# EAGLE design BreaV7 (EAGLE 9.1.3)

## Sheet 1 of 3
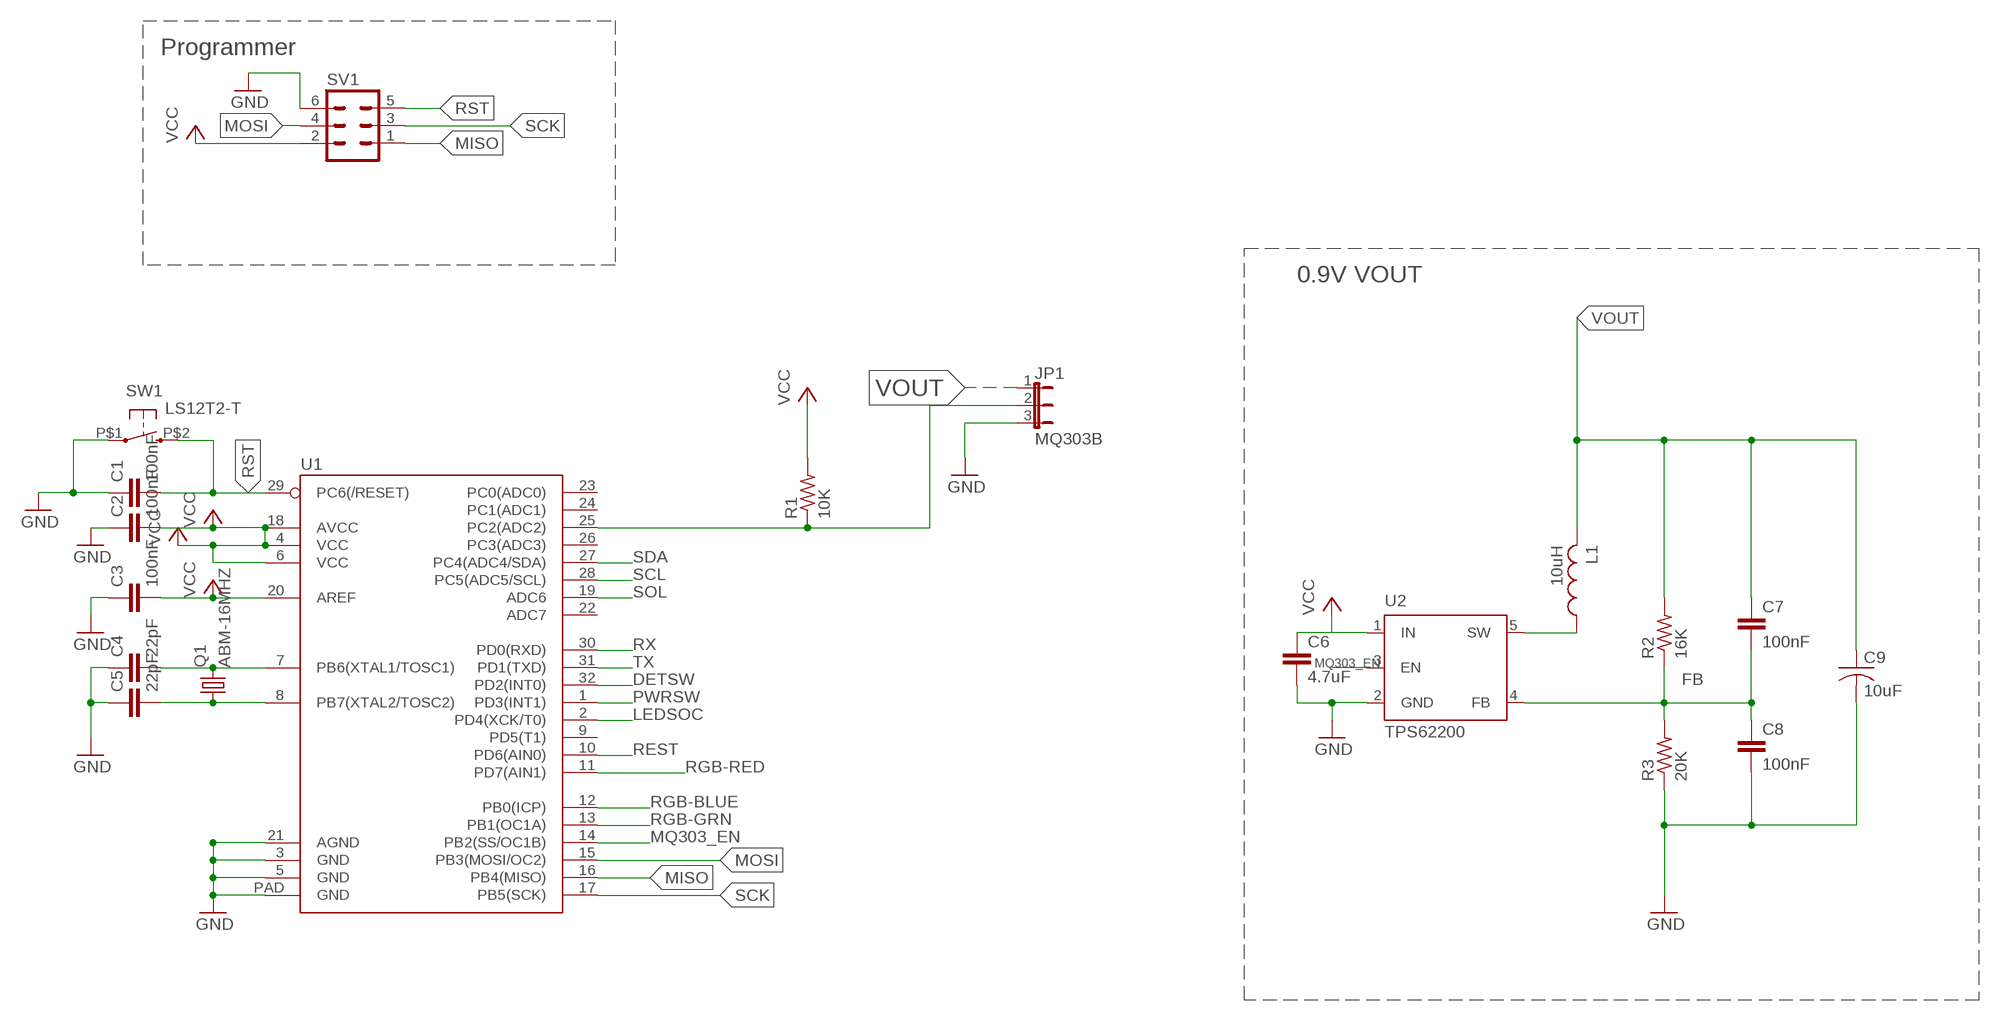
[diagram p0: schematic, sheet 1]

### Parts
C1  100nF  C-EUC0603  [C0603]
C2  100nF  C-EUC0603  [C0603]
C3  100nF  C-EUC0603  [C0603]
C4  22pF  C-EUC0603  [C0603]
C5  22pF  C-EUC0603  [C0603]
C6  4.7uF  C-EUC0402  [C0402]
C7  100nF  C-EUC0402  [C0402]
C8  100nF  C-EUC0402  [C0402]
C9  10uF  C-USC0805K  [C0805K]
JP1  MQ303B  JP2E  [JP2]
L1  10uH  L-USL2825P  [L2825P]
Q1  ABM-16MHZ  [ABM-16MHZ]
R1  10K  R-US_R0402  [R0402]
R2  16K  R-US_R0402  [R0402]
R3  20K  R-US_R0402  [R0402]
SV1  MA03-2  [MA03-2]
SW1  LS12T2-T  [LS12T2-T]
U1  ATMEGA328P_MLFMLF32  [MLF32-PAD]
U2  TPS62200  [TPS62200]

### Nets
DETSW: U1.32(PD2(INT0)) ; also sheet 2
FB: C7.2 C8.1 R2.1 R3.2 U2.4(FB)
GND: C1.1 C2.1 C3.1 C4.1 C5.1 C6.2 C8.2 C9.2 JP1.3 R3.1 SV1.6(MISO) SW1.P$1(S1) U1.3(GND) U1.5(GND) U1.21(AGND) U1.PAD(GND) U2.2(GND) ; also sheet 2,3
LEDSOC: U1.2(PD4(XCK/T0))
MISO: SV1.1 U1.16(PB4(MISO))
MOSI: SV1.4 U1.15(PB3(MOSI/OC2))
MQ303_EN: U1.14(PB2(SS/OC1B)) U2.3(EN)
N$1: C5.2 Q1.P$1 U1.8(PB7(XTAL2/TOSC2))
N$2: C4.2 Q1.P$2 U1.7(PB6(XTAL1/TOSC1))
N$3: JP1.2 R1.1 U1.25(PC2(ADC2))
N$7: C6.1 U2.1(IN)
PWRSW: U1.1(PD3(INT1)) ; also sheet 2
REST: U1.10(PD6(AIN0)) ; also sheet 2
RGB-BLUE: U1.12(PB0(ICP)) ; also sheet 2
RGB-GRN: U1.13(PB1(OC1A)) ; also sheet 2
RGB-RED: U1.11(PD7(AIN1)) ; also sheet 2
RST: C1.2 SV1.5(VTG) SW1.P$2(S2) U1.29(PC6(/RESET))
RX: U1.30(PD0(RXD)) ; also sheet 2
SCK: SV1.3 U1.17(PB5(SCK))
SCL: U1.28(PC5(ADC5/SCL)) ; also sheet 3
SDA: U1.27(PC4(ADC4/SDA)) ; also sheet 3
SOL: U1.19(ADC6) ; also sheet 2
SW: L1.1 U2.5(SW)
TX: U1.31(PD1(TXD)) ; also sheet 2
VCC: C2.2 C3.2 R1.2 SV1.2 U1.4(VCC) U1.6(VCC) U1.18(AVCC) U1.20(AREF) ; also sheet 2,3
VOUT: C7.1 C9.1 JP1.1 L1.2 R2.2
Unconnected: U1.9(PD5(T1)) U1.22(ADC7) U1.23(PC0(ADC0)) U1.24(PC1(ADC1)) U1.26(PC3(ADC3))

### Notes on the sheet
- Programmer
- 0.9V VOUT

## Sheet 2 of 3
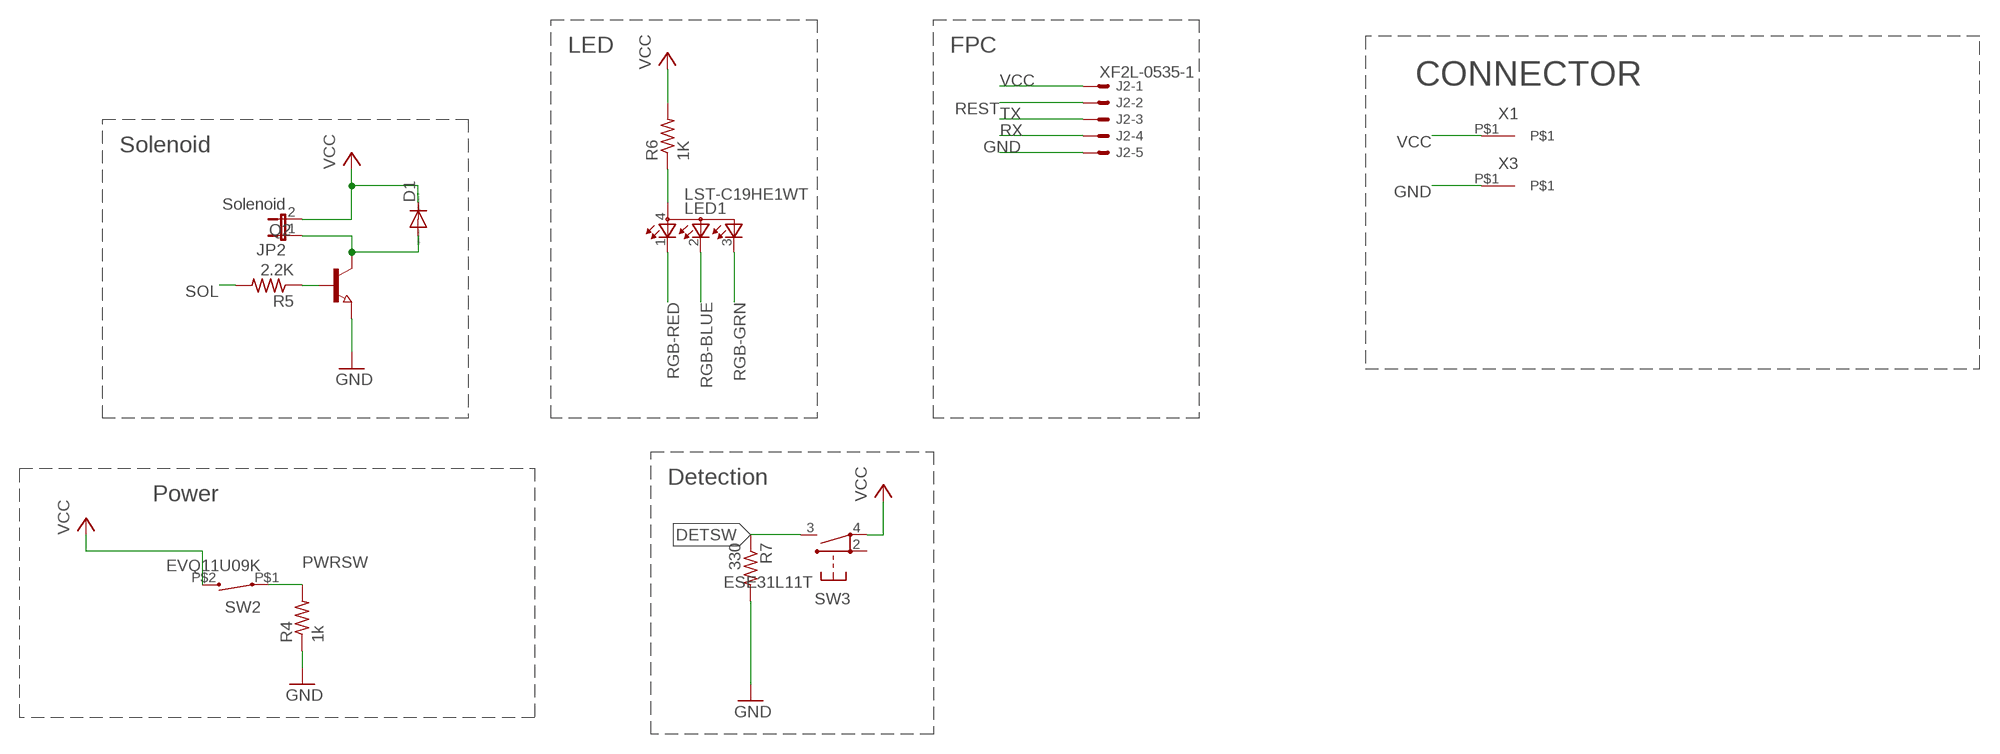
[diagram p1: schematic, sheet 2]

### Parts
D1  DIODE-SOD123  [SOD123]
J2  XF2L-0535-1  [XF2L-0535-1]
JP2  Solenoid  JP1E  [JP1]
LED1  LST-C19HE1WT  [LST-C19HE1WT]
Q2  NPN-TRANSISTOR_SOT23  [SOT23]
R4  1k  R-US_R0402  [R0402]
R5  2.2K  R-US_R0402  [R0402]
R6  1K  R-US_R0402  [R0402]
R7  330  R-US_R0402  [R0402]
SW2  EVQ11U09K  [EVQ11U-09K]
SW3  ESE31L11T  [SWITCH]
X1  CON-1PIN  [CON-1PIN]
X3  CON-1PIN  [CON-1PIN]

### Nets
DETSW: R7.1 SW3.3 ; also sheet 1
GND: J2.5 Q2.2(E) R4.1 R7.2 X3.P$1 ; also sheet 1,3
N$5: LED1.4(A) R6.1
N$9: D1.A JP2.1 Q2.3(C)
N$10: Q2.1(B) R5.1
PWRSW: R4.2 SW2.P$1 ; also sheet 1
REST: J2.2 ; also sheet 1
RGB-BLUE: LED1.2(CGREEN) ; also sheet 1
RGB-GRN: LED1.3(CBLUE) ; also sheet 1
RGB-RED: LED1.1(CRED) ; also sheet 1
RX: J2.4 ; also sheet 1
SOL: R5.2 ; also sheet 1
TX: J2.3 ; also sheet 1
VCC: D1.C J2.1 JP2.2 R6.2 SW2.P$2 SW3.4(C3) X1.P$1 ; also sheet 1,3
Unconnected: SW3.2(C2)

### Notes on the sheet
- LED | FPC
- CONNECTOR
- Solenoid
- Detection
- Power

## Sheet 3 of 3
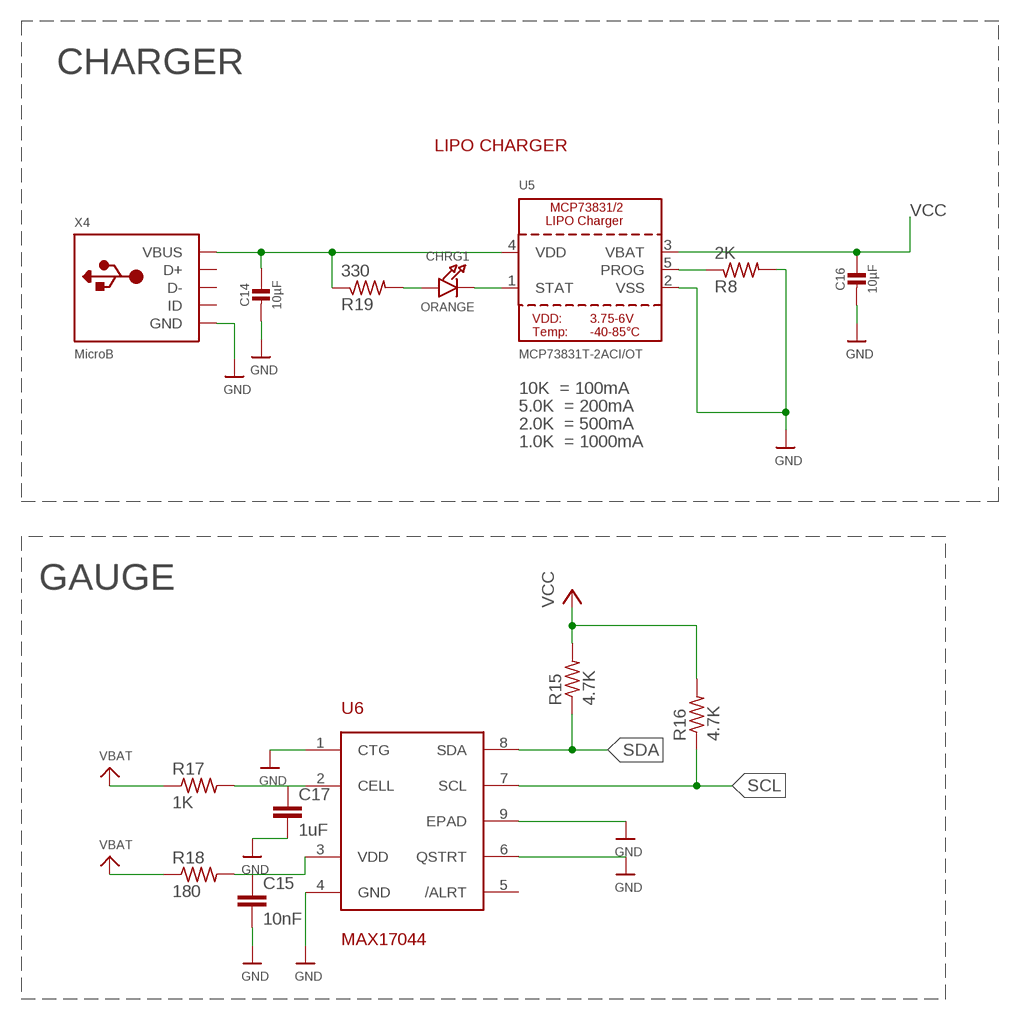
[diagram p2: schematic, sheet 3]

### Parts
C14  10µF  CAP_CERAMIC0805-NOOUTLINE  [0805-NO]
C15  10nF  C-EUC0603  [C0603]
C16  10µF  CAP_CERAMIC0805-NOOUTLINE  [0805-NO]
C17  1uF  C-EUC0603  [C0603]
CHRG1  ORANGE  LED0805_NOOUTLINE  [CHIPLED_0805_NOOUTLINE]
R8  2K  R-US_R0402  [R0402]
R15  4.7K  R-US_R0402  [R0402]
R16  4.7K  R-US_R0402  [R0402]
R17  1K  R-US_R0402  [R0402]
R18  180  R-US_R0402  [R0402]
R19  330  R-US_R0402  [R0402]
U5  MCP73831T-2ACI/OT  MCP73831/2  [SOT23-5]
U6  MAX17044  [TDFN]
X4  MicroB  USBMICRO_20329  [4UCONN_20329]

### Nets
GND: C14.2 C15.2 C16.2 C17.2 R8.2 U5.2(VSS) U6.1(CTG) U6.4(GND) U6.6(QSTRT) U6.9(EPAD) X4.BASE@1(GND) X4.BASE@2(GND) X4.GND X4.SPRT@1(GND) X4.SPRT@2(GND) X4.SPRT@3(GND) X4.SPRT@4(GND) ; also sheet 1,2
N$12: R8.1 U5.5(PROG)
N$13: C17.1 R17.2 U6.2(CELL)
N$15: C15.1 R18.2 U6.3(VDD)
N$16: CHRG1.A R19.2
N$17: CHRG1.C U5.1(STAT)
SCL: R16.1 U6.7(SCL) ; also sheet 1
SDA: R15.1 U6.8(SDA) ; also sheet 1
VBUS2: C14.1 R19.1 U5.4(VDD) X4.VBUS
VCC: C16.1 R15.2 R16.2 R17.1 R18.1 U5.3(VBAT) ; supply symbol labelled VBAT ; also sheet 1,2
Unconnected: U6.5(/ALRT) X4.D+ X4.D- X4.ID

### Notes on the sheet
- CHARGER
- LIPO CHARGER
- 10K  = 100mA
- 5.0K  = 200mA
- 2.0K  = 500mA
- 1.0K  = 1000mA
- GAUGE

## Library data of the parts
C1-C8 C15 C17 = rcl:C-EU: CAPACITOR, European symbol
C9 = resistor:C-US: CAPACITOR, American symbol
C14 C16 = microbuilder:CAP_CERAMIC: Ceramic Capacitors For new designs, use the packages preceded by an '_' character since they are more reliable: The following footprints should be used on most boards: _0402 - Standard footprint for regular board layouts _0603 - Standard footprint for regular board layouts _0805 - Standard footprint for regular board layouts _1206 - Standard footprint for regular board layouts For extremely tight-pitch boards where space is at a premium, the following 'micro-pitch' footprints can be used (smaller pads, no silkscreen outline, etc.): _0402MP - Micro-pitch footprint for very dense/compact boards _0603MP - Micro-pitch footprint for very dense/compact boards _0805MP - Micro-pitch footprint for very dense/compact boards _1206MP - Micro-pitch footprint for very dense/compact boards
CHRG1 = microbuilder:LED: LED 0603 - 0603 Surface Mount Package 2mA: Green LED - Low Power (3.9mcd, 2ma, 1.7Vf) - Digikey: 475-2709-2-ND Orange LED - Low Power (9.8mcd, 2ma, 1.8Vf) - Digikey: 475-1194-2-ND Red LED - Low Power (5mcd, 2ma, 1.8Vf) - Digikey: 475-1195-2-ND Yellow LED - Low Power (7mcd, 2ma, 1.8Vf) - Digikey: 475-1196-2-ND 5mA: Blue LED - Low Power (17mcd, 5ma, 2.9Vf) - Digikey: LNJ937W8CRACT-ND 0805 - 0805 Surface Mount Package 2mA: Red LED (8.8mcd, 2mA, 1.8Vf, Clear) - Low Power [Digikey: 475-2510-1-ND] Green LED (5mcd, 2mA, 1.8Vf, Clear) - Low Power [Digikey: 475-2730-1-ND] Yellow LED (11.3mcd, 2mA, 1.8Vf, Clear) - Low Power [Digikey: 475-2555-1-ND] 20mA: Red LED (104mcd, 20mA, Diffused) - LS R976 [Digikey: 475-1278-6-ND] Red LED (12mcd, 20mA, 2.0Vf, Clear) - APT2012EC [Digikey: 754-1128-1-ND] Green LED (15mcd, 20mA, 2.2Vf, Clear) - APT2012GC [Digikey: 754-1131-1-ND] Orange LED (160mcd, 20mA, 2.1Vf, Clear) - APT2012SECK [Digikey: 754-1130-1-ND] 1206 - 1206 Surface Mount Package Green LED (26mcd, 20mA, Diffused) - LG N971 [Digikey: 475-1407-6-ND] Red LED (15mcd, 20mA, Diffused) - LH N974 [Digikey: 475-1416-6-ND] Cree - Cree High-Power Surface Mount LEDs XPEBWT-L1-0000-00D50 - White 111lm 350mA 2.9Vf 6200K 110° XTEAWT-00-0000-00000LEE3 - White 114lm 350mA 2.85Vf 5000K 115° Everlight - Everlight 45-21 Series Surface Mount LEDs 45-21/QK2C-B2832AC2CB2/2T - Warm White 2000mcd 20mA 3.25Vf 3050K 120° 45-21/LK2C-B38452C4CB2/2T - Nuetral White 2000mcd 20mA 3.25Vf 4150K 120° 45-21/LK2C-B50634C6CB2/2T - Cold White 2200mcd 20mA 3.25Vf 5650K 120° PLCC2 Reverse Mount LS T77K-J1L2-1-0-2-R18-Z - Red 11.25mcd 2mA 1.8Vf 630nm 120° LO T77K-L1M2-24-Z - Orange 19.6mcd 2mA 1.8Vf 606nm 120° LY T77K-K2M1-26-Z - Yellow 15.7mcd 2mA 1.8Vf 587nm 120°
D1 = diode:DIODE-: DIODE
J2 = adafruit:XF2*-05?: OMRON FPC Connector Source : http://www.omron.com/ecb/products/pdf/fpc.pdf
JP1 = jumper:JP2E: JUMPER
JP2 = jumper:JP1E: JUMPER
L1 = resistor:L-US: INDUCTOR, American symbol
LED1 = led:LST-C19HE1WT
Q1 = NewPart:ABM-16MHZ: Crystal 16MHz 18pF
Q2 = semicon-smd-ipc:NPN-TRANSISTOR_: NPN TRANSISTOR
R1-R8 R15-R19 = resistor:R-US_: RESISTOR, American symbol
SV1 = con-lstb:MA03-2: PIN HEADER; OC_FARNELL: unknown; OC_NEWARK: unknown
SW1 = NewPart:LS12T2-T: Side Switch for hardware reset
SW2 = NewPart:EVQ11U09K
SW3 = NewPart:ESE31L11T: Panasonic Detector Switch
U1 = SparkFun-DigitalIC:ATMEGA328P_MLF: 32-Pin Atmega328 part Commonly used on Arduino compatible boards Available in QFP and QFN packages TQFP is IC-09069 QFN is non-stock
U2 = NewPart:TPS62200: TI TPS62200 Buck Converter
U5 = microbuilder:MCP73831/2: MCP73831/2 LIPO Charger VDD: 3.75 - 6V Temp -40 - 85°C Programmable Charge Rate: 15-500mA NOTE: STAT is a tri-state logic output on the MCP73831 and an open-drain output on the MCP73832. SOT23-5 with 4.2V output and tri-state logic on STAT = MCP73831T-2ACI/OT
U6 = NewPart:MAX17044
X1 X3 = NewPart:CON-1PIN: THROUGH HOLE FOR 1-PIN CONNECTOR
X4 = microbuilder:USB: USB Connectors USBMINIB - Surface Mount Female Mini-B USB Connector 4UConnector: 06564

## Board
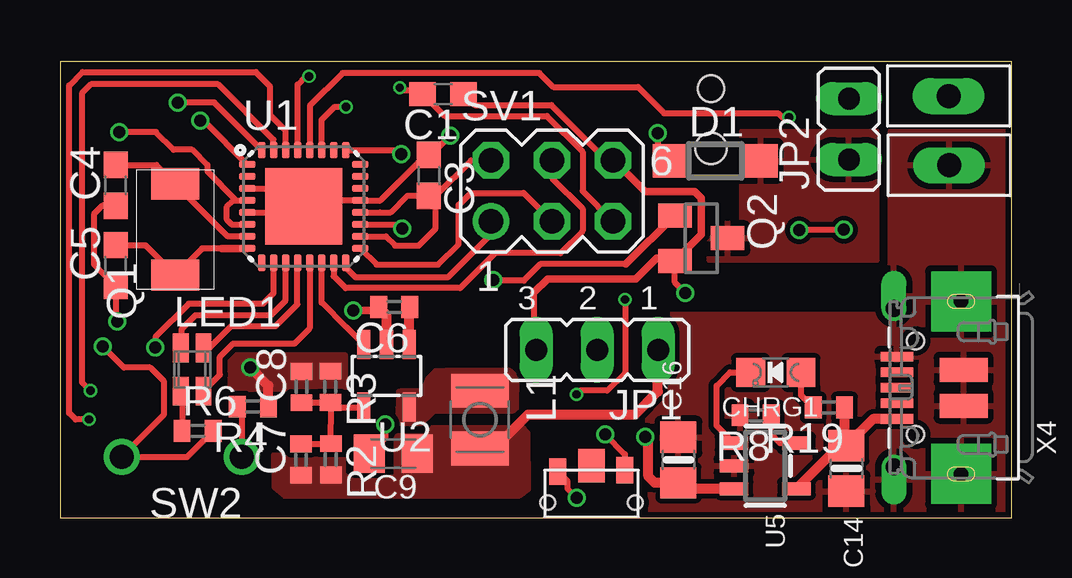
[diagram p3: board, top side]
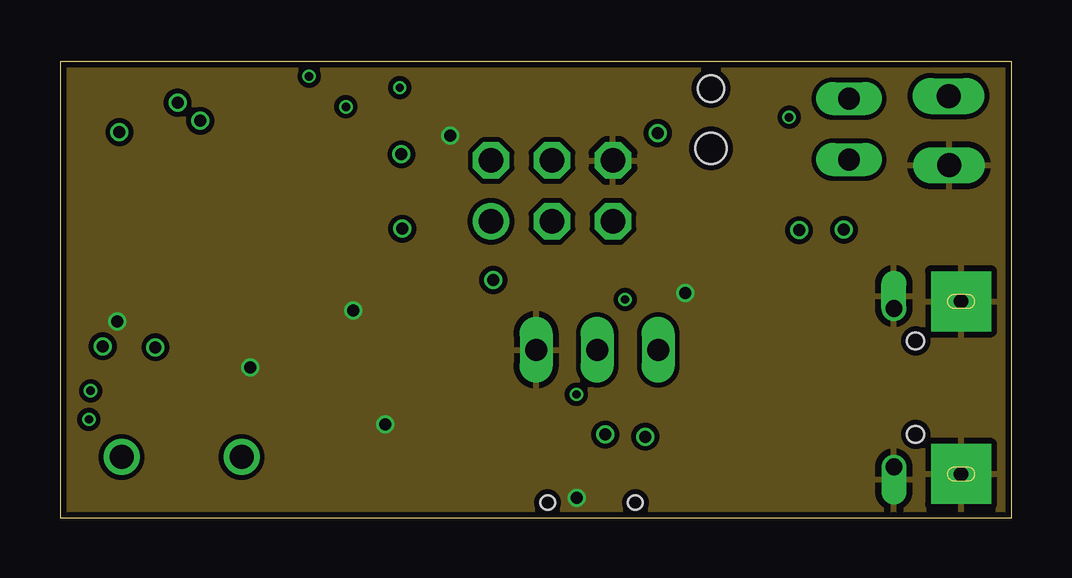
[diagram p4: board, inner layer Route2]
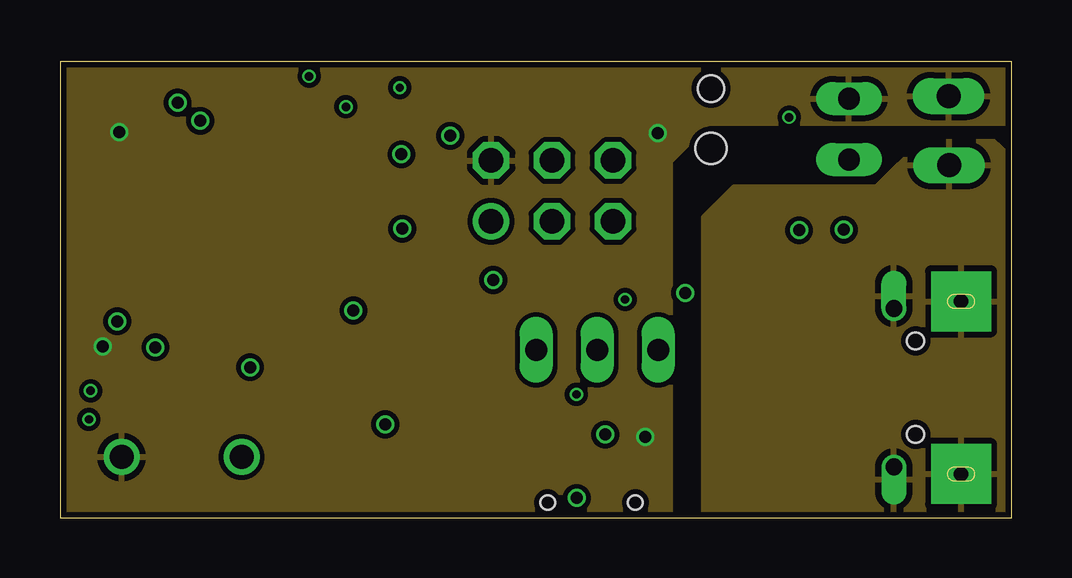
[diagram p5: board, inner layer Route15]
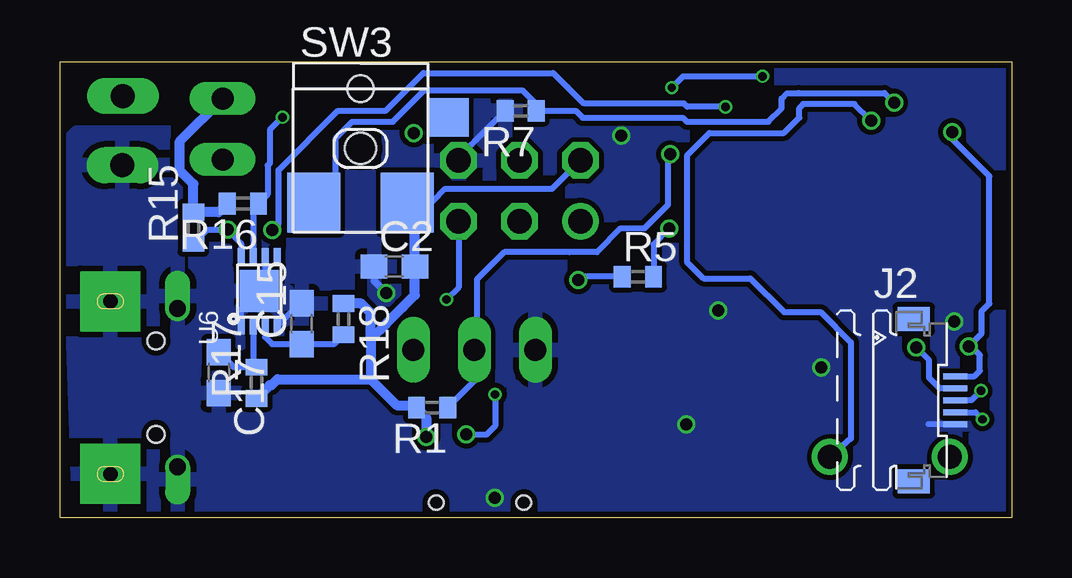
[diagram p6: board, bottom side, seen from below]

Size 39.65 x 19.03 mm. Coordinates in mm from the lower left corner, seen from the top.
Outline: 0,0 39.65,0 39.65,19.03 0,19.03 0,0
Copper layers (1*2*15*16): Top 0.035mm / dielectric 0.2mm / Route2 0.0175mm / dielectric 0.3mm / Route15 0.0175mm / dielectric 0.2mm / Bottom 0.035mm
Design rules "SeeedStudio_4layer_DRU_no_angle_20140221": minimum track width 8mil, minimum drill 12mil, track to track 8mil, track to pad 8mil, pad to pad 8mil, via to via 8mil, smd to smd 0mil, copper to edge 10mil, drill to drill 8mil, minimum pad ring 6mil, minimum via ring 4mil, stop-mask expansion 4mil, vias tented up to drill 25mil, thermal gap 10mil

### Footprints (pad centres in the part's own frame; a part is rotated, then mirrored left to right if it is on the bottom)
C0603 = smd 1.1 x 1: 1 -0.85,0; 2 0.85,0
C0402 = smd 0.7 x 0.9: 1 -0.65,0; 2 0.65,0
C0805K = smd 1.3 x 1.6: 1 -1,0; 2 1,0
0805-NO = smd 1.3 x 1.5: 1 -0.95,0; 2 0.95,0
CHIPLED_0805_NOOUTLINE = smd 1.2 x 1.2: A 0,-1.05; C 0,1.05
SOD123 = smd 1.4 x 1.4: A 1.9,0; C -1.9,0
XF2L-0535-1 = smd 1 x 0.25: 1 1.905,1; 2 1.905,0.5; 3 1.905,0; 4 1.905,-0.5; 5 1.905,-1 | smd 1.34 x 1: M1 0.18,3.388; M2 0.18,-3.388
JP2 = drill 0.914 long: 1 -2.54,0; 2 0,0; 3 2.54,0
JP1 = drill 0.914 long: 1 0,-1.27; 2 0,1.27
L2825P = smd 1.4 x 2.4: 1 -1.2,0; 2 1.2,0
LST-C19HE1WT = smd 0.65 x 1.2: 1 -0.475,0.9; 2 0.475,0.9; 3 0.475,-0.9; 4 -0.475,-0.9
ABM-16MHZ = smd 1.3 x 2: P$1 0.6,-1.6; P$2 4.4,-1.6
SOT23 = smd 1 x 1.4: 1 -0.95,-1.1; 2 0.95,-1.1; 3 0,1.1
R0402 = smd 0.7 x 0.9: 1 -0.65,0; 2 0.65,0
MA03-2 = drill 1.016: 1 -2.54,-1.27 | drill 1.016 octagon: 2 -2.54,1.27; 3 0,-1.27; 4 0,1.27; 5 2.54,-1.27; 6 2.54,1.27
LS12T2-T = smd 1.1 x 0.7: P$1 0.05,-1.41; P$2 0,1.39 | smd 1.4 x 1.1: P$3 -0.2,0 | hole 0.6: 1.35,-1.825; 1.35,1.825
EVQ11U-09K = drill 1: P$1 -2.5,0; P$2 2.5,0
SWITCH = smd 1.7 x 1.6: 2 3.65,1.3 | smd 2.2 x 2.5: 3 -1.95,-2.25; 4 1.95,-2.25 | hole 1.1: 0,2.5 | hole 1.3: 0,0
MLF32-PAD = smd 0.7 x 0.3: 1 -2.35,1.75; 2 -2.35,1.25; 3 -2.35,0.75; 4 -2.35,0.25; 5 -2.35,-0.25; 6 -2.35,-0.75; 7 -2.35,-1.25; 8 -2.35,-1.75; 17 2.35,-1.75; 18 2.35,-1.25; 19 2.35,-0.75; 20 2.35,-0.25; 21 2.35,0.25; 22 2.35,0.75; 23 2.35,1.25; 24 2.35,1.75 | smd 0.3 x 0.7: 9 -1.75,-2.35; 10 -1.25,-2.35; 11 -0.75,-2.35; 12 -0.25,-2.35; 13 0.25,-2.35; 14 0.75,-2.35; 15 1.25,-2.35; 16 1.75,-2.35; 25 1.75,2.35; 26 1.25,2.35; 27 0.75,2.35; 28 0.25,2.35; 29 -0.25,2.35; 30 -0.75,2.35; 31 -1.25,2.35; 32 -1.75,2.35 | smd 3.2 x 3.2: PAD 0,0
TPS62200 = smd 0.55 x 1.2: 1 -0.95,-1.3; 2 0,-1.3; 3 0.95,-1.3; 4 0.95,1.3; 5 -0.95,1.3
SOT23-5 = smd 0.55 x 1.2: 1 -0.95,-1.3; 2 0,-1.3; 3 0.95,-1.3; 4 0.95,1.3; 5 -0.95,1.3
TDFN = smd 0.3 x 0.7: 1 -0.75,-1.45; 2 -0.25,-1.45; 3 0.25,-1.45; 4 0.75,-1.45; 5 0.75,1.45; 6 0.25,1.45; 7 -0.25,1.45; 8 -0.75,1.45 | smd 1.63 x 1.75: 9 0,0
CON-1PIN = drill 1 long: P$1 0,0
4UCONN_20329 = smd 1 x 2: BASE@1 -0.75,-2; BASE@2 0.75,-2 | smd 0.4 x 1.35: D+ 0,0.775; D- -0.65,0.775; GND 1.3,0.775; ID 0.65,0.775; VBUS -1.3,0.775 | drill 0.7 offset: SPRT@1 -3.3,0.9; SPRT@2 3.3,0.9 | drill 0.6 pad 2.5 square: SPRT@3 -3.6,-1.9; SPRT@4 3.6,-1.9 | hole 0.7: -1.95,0; 1.95,0

### Placement (x,y rotation side)
C1  15.96,17.68 180 top
C2  25.71,10.47 0 bottom
C3  15.36,14.28 270 top
C4  2.31,13.87 90 top
C5  2.31,10.53 90 top
C6  13.93,8.79 180 top
C7  10.04,2.43 90 top
C8  10.06,5.46 90 top
C9  13.88,2.68 180 top
C14  32.77,2.07 270 top
C15  29.58,8.1 90 bottom
C16  25.77,2.42 90 top
C17  33.04,6.06 270 bottom
CHRG1  29.83,6.07 90 top
D1  27.3,14.89 0 top
J2  4.26,4.91 0 bottom
JP1  22.38,7.01 180 top
JP2  32.87,16.21 0 top
L1  17.5,4.1 270 top
LED1  5.51,6.19 0 top
Q1  3.21,9.53 90 top
Q2  26.72,11.66 270 top
R1  24.14,4.6 180 bottom
R2  11.28,2.44 270 top
R3  11.27,5.47 270 top
R4  8.04,4.65 180 top
R5  15.57,10.06 0 bottom
R6  5.74,3.63 0 top
R7  20.45,16.98 180 bottom
R8  28.99,4.28 180 top
R15  34.09,12.1 90 bottom
R16  32.03,13.11 180 bottom
R17  31.46,5.64 90 bottom
R18  27.84,8.29 270 bottom
R19  32.04,4.61 180 top
SV1  20.5,13.64 0 top
SW1  22.15,1.99 270 top
SW2  5.07,2.54 180 top
SW3  27.12,15.4 0 bottom
U1  10.16,12.99 0 top
U2  13.61,5.93 180 top
U5  29.39,2.17 270 top
U6  31.35,9.46 0 bottom
X1  37.03,17.6 90 top
X3  37.05,14.71 90 top
X4  35.65,5.43 90 top

### Tracks (layer width: path | path; a pad name or v marks a point on that pad's centre or on a via)
DETSW  (via drill 0.5)
  Top 0.254: v4.9,17.32 6.43,17.32 U1.32
  Bottom 0.254: SW3.3 29.01,13.09 28.15,13.94 28.15,15.83 27.47,16.52 25.78,16.52 24.46,17.83 20.38,17.83 19.8,17.25 R7.1 18.16,16.98 17.87,16.68 16.2,16.68 13.7,16.68 13.53,16.52 10.13,16.52 9.58,17.07 9.58,17.49 9.36,17.71 8.88,17.71 8.87,17.71 5.29,17.71 v4.9,17.32
FB
  Top 0.254: R3.2 11.04,4.61 12.64,4.61 U2.4 | C7.2 R2.1 11.29,4.73 R3.2 | C8.1 arc-90 10.08,4.82 R3.2
GND  (via drill 0.5)
  Top 0.254: U1.3 9.41,13.74 U1.PAD | U1.5 9.91,12.74 U1.PAD | U1.PAD 10.41,13.24 U1.21 13.35,13.24 15.11,15 15.23,15 C3.1 15.46,15.13 v16.26,15.93 | C4.1 1.76,13.01 1.42,12.67 1.42,10.57 C5.1 2.31,8.27 v2.39,8.2 | v13.55,3.9 13.55,3.35 C9.2 | 19.74,9.39 19.74,7.11 JP1.3 | v26.06,9.38 25.62,9.82 Q2.2 | C1.1 17.28,17.21 20.47,17.21 22.78,14.91 SV1.6 | SW1.P$1 21.14,1.54 21.14,1.22 v21.53,0.83
  Top 0.305: SV1.6 23.09,14.91 24.39,13.61 26.45,13.61 26.73,13.33 26.73,11.82 Q2.2 | v12.23,8.65 13.14,8.65 C6.2 | Q2.2 | 19.74,9.39 20.32,9.97 24,9.97 24.86,10.83 25.5,10.83 Q2.2
  Top 0.406: U2.2 13.61,8.46 C6.2 | R4.1 8.69,5.51 v7.92,6.28
  Bottom 0.254: J2.5 3.46,3.91 | C15.2 29.66,8.95 U6.4 | U6.1 32.1,8.71 U6.9 31.1,9.71 U6.6 | SV1.6 23.04,15.03 22.5,15.57 22.49,15.57 22.29,15.77 22.29,15.78 R7.2
  Bottom 0.305: v26.06,9.38 26.56,9.88 C2.1
  pour Top (no thermals): 7.29,6.79 11.87,6.79 11.87,5.37 8.89,5.37 7.27,5.34 7.12,5.49 7.08,6.57
  pour Bottom: 0.25,18.96 29.59,18.71 29.59,16.92 30.45,16.06 38.96,16.06 39.21,15.81 39.21,10.41 38.86,0.42 34.47,0.16 0.5,0.16 0.25,0.42
  pour Route2: 0.21,18.88 39.43,18.88 39.43,0.1 0.21,0.1 0.21,18.87
  pour Top: 34.63,16.12 39.49,16.12 39.49,-0.02 24.25,-0.02 24.25,8.48 34.62,8.48 34.62,16.14
  pour Route15: 34.04,13.79 35.95,15.7 38.88,15.7 39.42,15.21 39.42,0.15 26.84,0.15 26.84,12.54 28.08,13.79
MISO
  Top 0.254: U1.16 11.91,10.44 12.31,10.04 16.18,10.04 17.93,11.79 17.93,12.33 SV1.1
MOSI
  Top 0.254: SV1.4 20.52,14.89 20.52,14.16 21.78,12.9 21.78,11.96 20.85,11.03 18.13,11.03 16.68,9.58 11.91,9.58 11.41,10.08 U1.15
MQ303_EN
  Top 0.254: U2.3 11.94,7.94 10.91,8.97 U1.14
N$1
  Top 0.254: 6.74,11.24 5.92,11.24 Q1.P$1 3.56,11.38 C5.2
  Top 0.305: U1.8 6.74,11.24
N$2
  Top 0.254: U1.7 7,11.74 Q1.P$2 4.02,14.71 C4.2
N$3  (via drill 0.5)
  Top 0.254: v14.23,15.16 14.05,15.34 U1.25
  Bottom 0.254: R1.1 22.38,5.72 JP1.2 22.28,7.11 22.28,9.94 21.14,11.08 18.43,11.08 17.27,11.08 16.28,12.08 15.29,12.08 14.31,13.06 14.31,15.09 v14.23,15.16
N$5
  Top 0.254: LED1.4 5.09,5.23 R6.1
N$7
  Top 0.406: U2.1 14.56,8.77 C6.1
N$9
  pour Top: 28.43,16.12 34.02,16.12 34.02,10.75 27.07,10.75 27.07,12.27 28.43,12.27
N$10  (via drill 0.5)
  Top 0.254: 23.58,10.58 20.01,10.58 19.33,9.9 18.07,9.9 v18.05,9.92
  Top 0.305: Q2.1 23.58,10.58
  Bottom 0.254: R5.1 17.91,10.06 v18.05,9.92
N$12
  Top 0.254: U5.5 30,3.12 29.64,3.48 R8.1
N$13
  Bottom 0.254: C17.1 32.42,6.29 R17.2 31.6,6.43 U6.2
N$15
  Bottom 0.254: 29.75,7.25 C15.1 28.23,7.25 R18.2 | 29.69,7.25 29.75,7.25 | 29.75,7.25 30.8,7.25 31.1,7.54 U6.3
N$16
  Top 0.254: R19.2 30.88,5.12 CHRG1.A
N$17
  Top 0.254: U5.1 27.36,3.85 27.36,5.51 27.92,6.07 CHRG1.C
PWRSW  (via drill 0.5)
  Top 0.254: R4.2 arc-90 7.57,4.47 SW2.P$1 | v5.85,16.56 5.99,16.56 U1.1
  Bottom 0.254: SW2.P$1 6.7,3.31 6.7,7.32 7.96,8.58 9.48,8.58 10.89,9.99 12.84,9.99 13.53,10.68 13.53,15.11 12.59,16.05 9.49,16.05 8.84,16.69 8.84,17.09 8.68,17.26 6.55,17.26 v5.85,16.56
REST  (via drill 0.5)
  Top 0.254: U1.10 8.91,9.38 8.46,8.93 5.36,8.93 3.98,7.54 v3.98,7.12
  Bottom 0.254: J2.2 3,5.41 3.44,5.85 3.44,6.58 v3.98,7.12
RGB-BLUE
  Top 0.254: LED1.2 6.22,7.09 7.13,8 8.99,8 9.89,8.9 9.89,10.62 U1.12
RGB-GRN
  Top 0.254: LED1.3 6.67,5.97 6.67,6.72 7.21,7.26 9.76,7.26 10.41,7.91 U1.13
RGB-RED
  Top 0.254: LED1.1 5.07,7.12 5.07,7.88 5.65,8.46 8.8,8.46 9.41,9.07 U1.11
RST  (via drill 0.35, 0.5)
  Top 0.254: SV1.5 21.78,13.63 21.78,15.27 20.29,16.76 16.03,16.76 C1.2 14.97,17.82 14.28,17.82 v14.16,17.94 | v22.72,3.48 23.54,2.66 SW1.P$2 | U1.29 9.91,18.07 10.25,18.42 v10.38,18.42 | v21.52,5.15 21.68,5.31 22.8,5.31 23.55,6.05 v23.55,9.11
  Bottom 0.254: v14.16,17.94 13.68,18.42 v10.38,18.42 | v23.55,9.11 23.04,9.61 SV1.5 | v21.52,5.15 21.52,3.83 21.88,3.47 v22.71,3.47 v22.72,3.48
RX  (via drill 0.35)
  Top 0.254: U1.30 9.39,15.35 9.39,16.17 8.76,16.8 8.76,17.68 8.76,17.99 8.16,18.59 0.94,18.59 0.38,18.03 0.38,4.37 0.65,4.11 v1.21,4.11
  Bottom 0.254: J2.4 1.51,4.41 v1.21,4.11
SCK
  Top 0.254: SV1.3 19.32,13.55 17.11,13.55 16.61,13.05 16.61,11.41 15.76,10.56 13.19,10.56 U1.17
SCL  (via drill 0.35)
  Top 0.254: U1.28 10.41,17.18 11.78,18.55 19.98,18.55 20.56,17.97 24.09,17.97 25.18,16.88 29.93,16.88 30.1,16.71 v30.38,16.71
  Bottom 0.254: v30.38,16.71 30.9,16.18 30.9,14.79 30.99,14.7 30.99,13.49 R16.1 31.6,12.89 U6.7
SDA  (via drill 0.35, 0.5)
  Top 0.254: U1.27 10.91,16.61 11.44,17.14 v11.91,17.14 | v30.8,12 30.82,12.02 v32.67,12.02
  Bottom 0.254: v11.91,17.14 13.51,17.14 13.65,17.28 17.82,17.28 18.51,17.97 18.52,17.97 19.1,18.55 24.5,18.55 26.08,16.97 28.07,16.97 30.54,14.51 30.54,12.26 v30.8,12 | U6.8 32.1,11.45 v32.67,12.02 33.52,12.02 R15.1
SOL  (via drill 0.5)
  Top 0.254: U1.19 14.08,12.24 v14.26,12.06
  Bottom 0.254: v14.26,12.06 14.92,11.4 R5.2
SW
  pour Top (no thermals): 14.19,5.26 14.12,5.26 14.1,4.04 14.25,3.94 15.03,3.96 15.32,4.21 15.59,4.48 15.95,4.48 18.86,4.46 19.02,4.6 19.03,5.88 18.75,6.12 16.45,6.14 15.65,6.11 15.34,5.79 15.07,5.27
TX  (via drill 0.35)
  Top 0.254: U1.31 8.89,15.36 8.89,15.78 6.59,18.08 1.29,18.08 0.92,17.71 0.92,5.66 v1.27,5.3
  Bottom 0.254: v1.27,5.3 1.67,4.91 J2.3
VBUS2
  Top 0.406: X4.VBUS 33.88,4.13 C14.1 | R19.1 32.69,3.1 C14.1 | U5.4 32.49,3.02 C14.1
VCC  (via drill 0.5)
  Top 0.254: U1.20 13.34,12.74 13.33,12.74 13.78,12.74 14.47,13.43 C3.2 15.66,13.43 | U1.6 7.15,12.24 6.96,12.43 6.96,12.98 7.21,13.24 U1.4 7.35,13.24 6.14,14.45 6.14,14.72 5.5,15.35 4.73,15.35 4,16.09 v2.48,16.09 | v24.91,16.05 24.91,15.38 D1.C | v1.78,7.16 2.66,6.27 3.76,6.27 4.32,5.71 4.32,4.28 SW2.P$2 5.3,2.54 R6.2 | 15.66,13.43 15.66,12.07 14.94,11.35 13.97,11.35 13.58,11.74 U1.18 | 26.02,1.22 C16.1 | 15.66,13.43 17.13,14.91 SV1.2
  Top 0.406: U5.3 26.02,1.22 | C16.1 24.78,1.47 24.52,1.73 24.52,3.26 v24.39,3.39
  Bottom 0.254: SV1.2 19.14,13.73 23.58,13.73 24.12,13.2 25.13,13.2 SW3.4 | v2.48,16.09 2.48,15.8 0.93,14.25 0.93,8.94 1.26,8.61 1.26,7.68 v1.78,7.16 1.69,7.16 1.32,6.79 1.32,6.14 1.55,5.91 J2.1
  Bottom 0.406: SW3.4 24.86,12.84 C2.2 24.86,9.29 25.36,8.79 25.37,8.79 26.01,8.15 26.01,8.14 26.7,7.45 | 26.7,5.78 25.61,4.69 24.88,4.69 R1.2 24.39,4.19 v24.39,3.39 | 26.7,7.45 26.7,5.78 | R17.1 30.91,5.53 30.84,5.53 30.59,5.78 26.7,5.78 | JP2.2 34.65,15.71 34.65,14.49 34.09,13.92 R15.2 33.04,12.75 32.99,12.8 32.98,12.8 R16.2 | 26.7,7.45 26.7,8.55 27.09,8.94 R18.1
  pour Route15: 0.22,18.9 39.49,18.9 39.49,16.42 39.44,16.47 27.02,16.47 25.4,14.85 25.4,0.17 0.21,0.14 0.21,18.89
VOUT
  Top 0.406: JP1.1 24.92,5.27 23.95,4.3 19.5,4.3 18.1,2.9 L1.2
  pour Top (no thermals): 8.93,2.62 11.63,2.61 11.78,2.47 11.77,1.86 11.91,1.7 13.86,1.69 14.03,1.75 14.03,3.35 14.09,3.41 15.3,3.43 15.55,3.75 15.82,3.76 19.29,3.75 19.48,3.53 19.5,1.19 19.12,0.92 9.4,0.89 8.95,1.28